# Altium schematic sheet RXTX_IF_1.SchDoc
size A
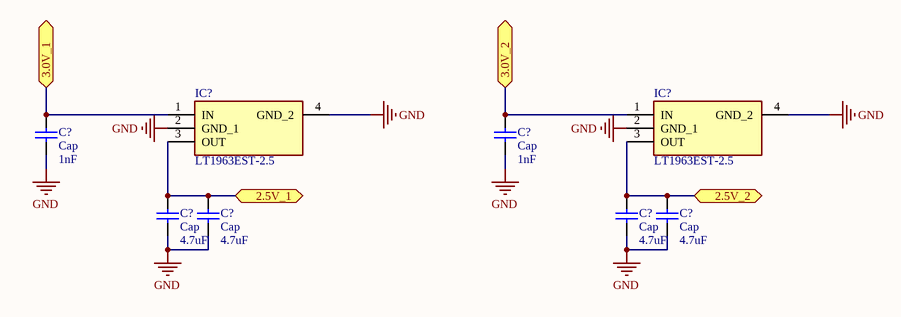
[diagram p0: RXTX_IF_1.SchDoc]

## Parts
(Parts that share a designator on the sheet are numbered #1, #2 ... from top to bottom, then left to right.)
C?#1  Cap  value 1nF  [0603]
C?#2  Cap  value 1nF  [0603]
C?#3  Cap  value 4.7uF  [0603]
C?#4  Cap  value 4.7uF  [0603]
C?#5  Cap  value 4.7uF  [0603]
C?#6  Cap  value 4.7uF  [0603]
IC?#1  LT1963EST-2.5  [SOT230P700X180-4N]
IC?#2  LT1963EST-2.5  [SOT230P700X180-4N]

## Ports
2.5V_1 (bidir), 2.5V_2 (bidir), 3.0V_1 (bidir), 3.0V_2 (bidir)

## Nets
GND: C?#1.1 C?#2.1 C?#3.1 C?#4.1 C?#5.1 C?#6.1 IC?#1.2(GND_1) IC?#1.4(GND_2) IC?#2.2(GND_1) IC?#2.4(GND_2)
2.5V_1: C?#3.2 C?#4.2 IC?#1.3(OUT) ; port 2.5V_1
2.5V_2: C?#5.2 C?#6.2 IC?#2.3(OUT) ; port 2.5V_2
3.0V_1: C?#1.2 IC?#1.1(IN) ; port 3.0V_1
3.0V_2: C?#2.2 IC?#2.1(IN) ; port 3.0V_2

## Library data of the parts
C?#1-C?#6 = Cap: Capacitor; Published: 8-Jun-2000; LatestRevisionDate: 17-Jul-2002; LatestRevisionNote: Re-released for DXP Platform.; PackageReference: RAD-0.3; Publisher: Altium Limited; PackageDescription: Radial Cap, Thru-Hole; 2 Leads; 0.3 in Pin Spacing
IC?#1 IC?#2 = LT1963EST-2.5: Integrated Circuit; Manufacturer_Name: Linear Technology; Datasheet Link: https://www.mouser.com/datasheet/2/609/1963fc-1270290.pdf; Height: 1.8mm; Manufacturer_Part_Number: LT1963EST-2.5; Mouser Part Number: 584-LT1963EST-2.5; Mouser Price/Stock: https://www.mouser.com/Search/Refine.aspx?Keyword=584-LT1963EST-2.5